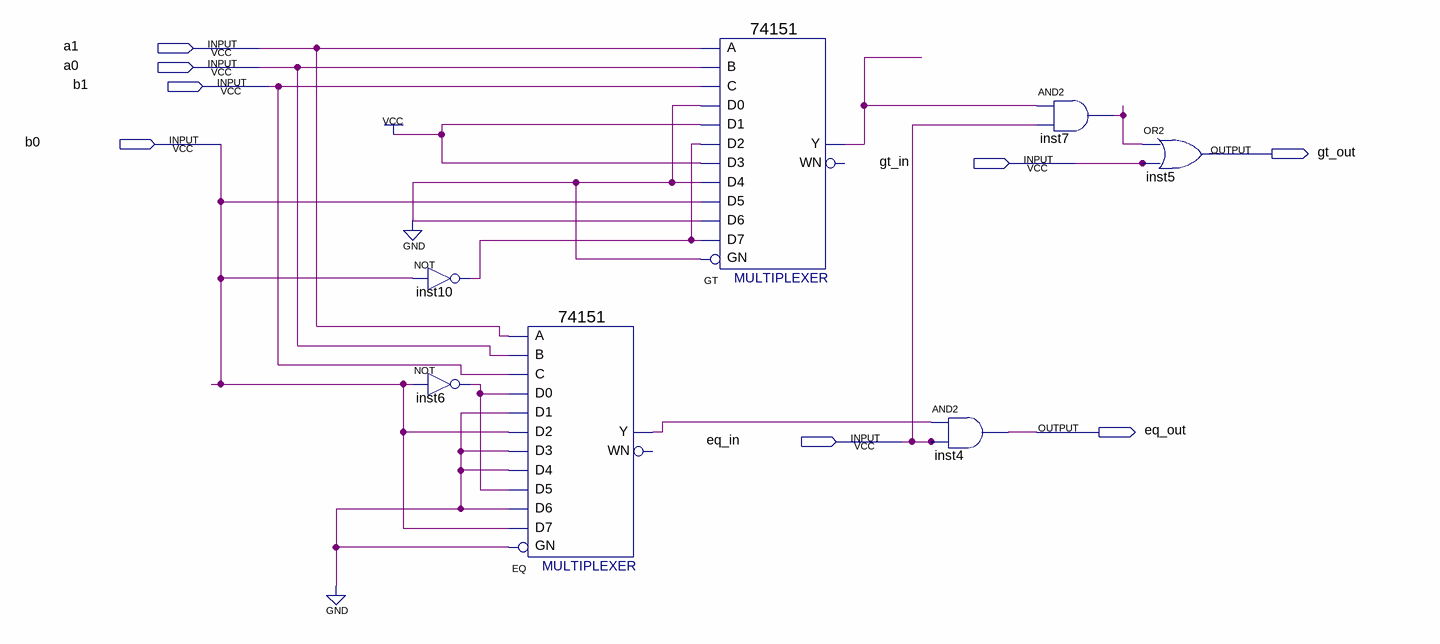
[diagram p0: schematic sheet]
// Quartus schematic twoBit.bdf as structural Verilog: 7 symbols, 8 pins
module twoBit (
  input  a1,
  input  a0,
  input  b1,
  input  b0,
  input  gt_in,
  input  eq_in,
  output gt_out,
  output eq_out
);

  wire EQ_y, GT_y, inst6_out, inst7_out, inst10_out;

  not inst10 (inst10_out, b0);
  not inst6 (inst6_out, b0);
  \74151  EQ (
    .GN(1'b0), .C(b1), .B(a0), .A(a1), .D5(inst6_out), .D0(inst6_out), .D1(1'b0), .D4(1'b0), .D3(1'b0),
    .D2(b0), .D6(1'b0), .D7(b0), .Y(EQ_y));  // open: WN
  \74151  GT (
    .GN(1'b0), .C(b1), .B(a0), .A(a1), .D5(b0), .D0(1'b0), .D1(1'b1), .D4(1'b0), .D3(1'b1), .D2(inst10_out),
    .D6(1'b0), .D7(inst10_out), .Y(GT_y));  // open: WN
  and inst4 (eq_out, EQ_y, eq_in);
  and inst7 (inst7_out, GT_y, eq_in);
  or inst5 (gt_out, inst7_out, gt_in);
endmodule
